# EAGLE design i2cdriver (EAGLE 6.4)
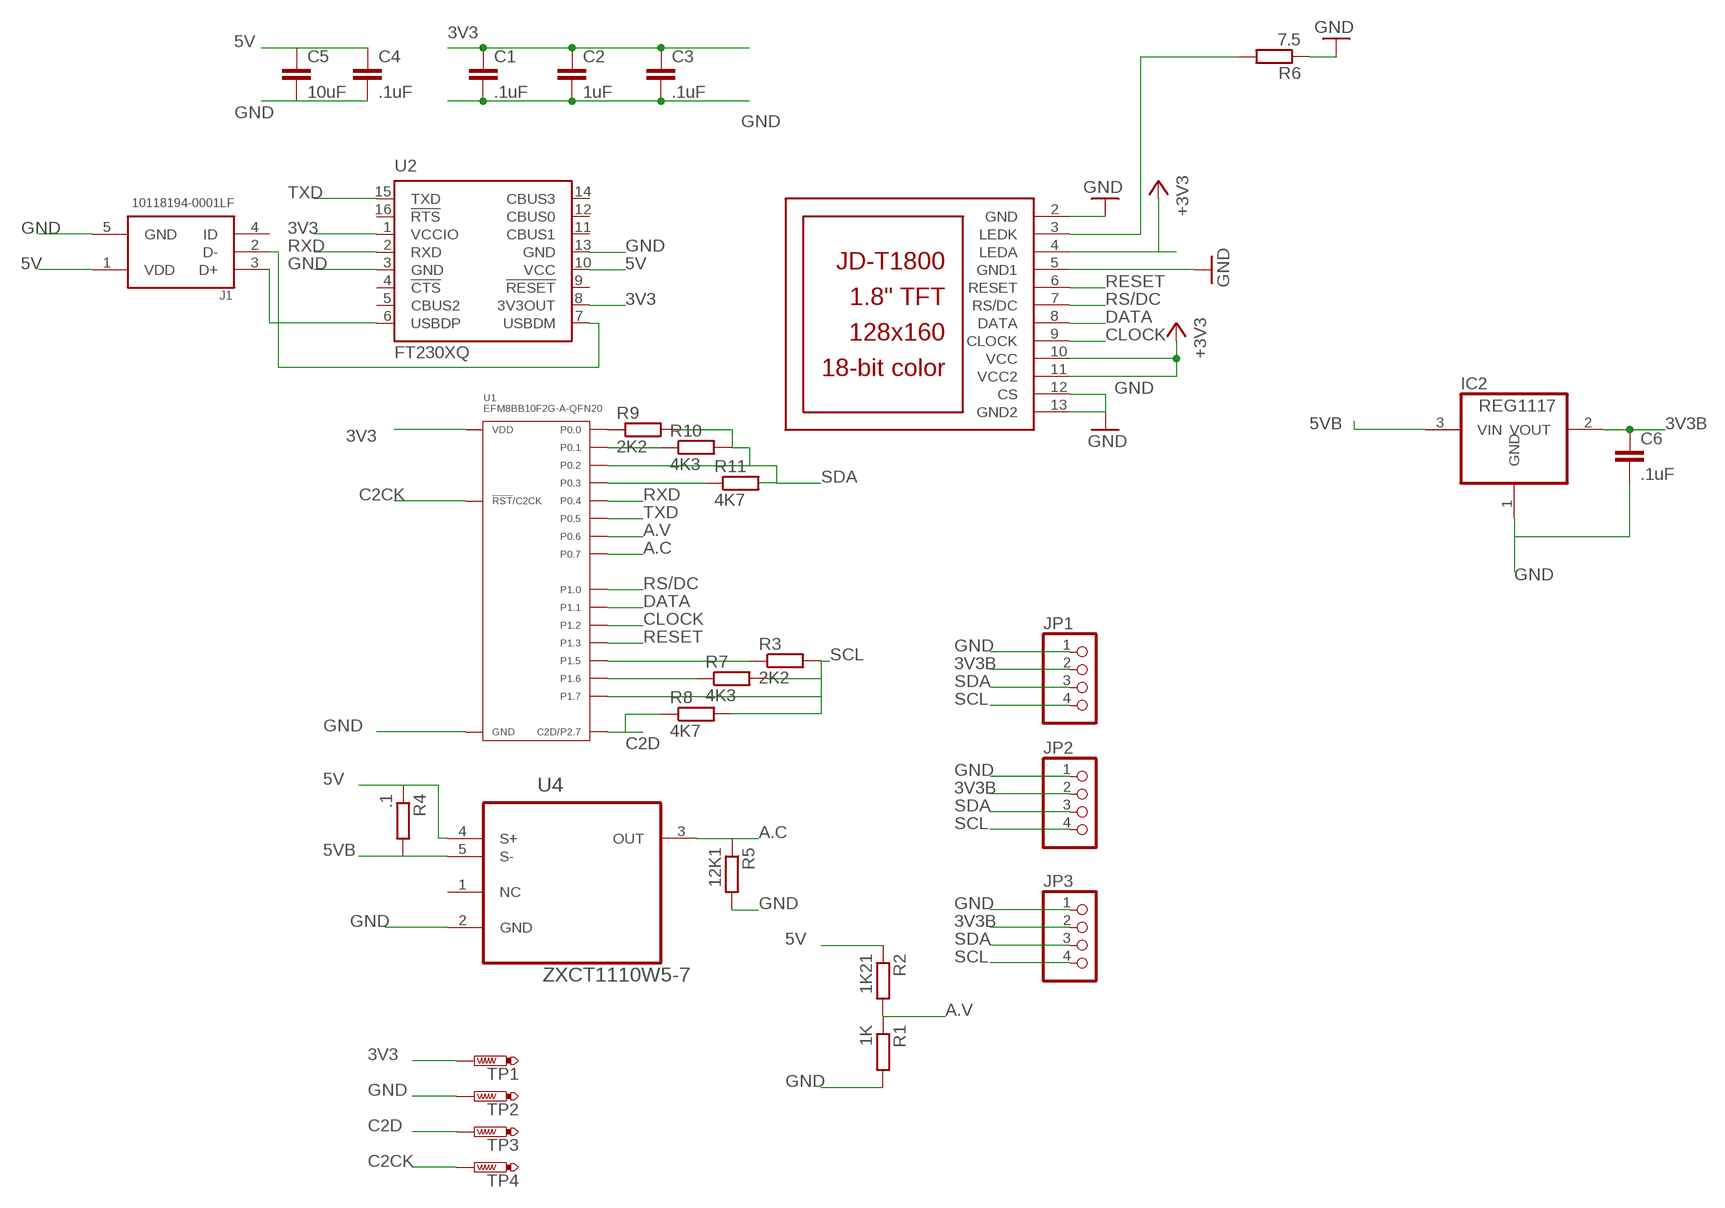
[diagram p0: schematic, sheet 1]

## Parts
C1  .1uF  C-EUC0402K  [C0402K]
C2  1uF  C-EUC0402K  [C0402K]
C3  .1uF  C-EUC0402K  [C0402K]
C4  .1uF  C-EUC0402K  [C0402K]
C5  10uF  C-EUC0402K  [C0402K]
C6  .1uF  C-EUC0402K  [C0402K]
IC2  REG1117  [SOT223]
J1  10118194-0001LF  [FRAMATOME_10118194-0001LF]
JP1  PINHD-1X4/90  [1X04/90]
JP2  PINHD-1X4/90  [1X04/90]
JP3  PINHD-1X4/90  [1X04/90]
R1  1K  R-EU_R0402  [R0402]
R2  1K21  R-EU_R0402  [R0402]
R3  2K2  R-EU_R0402  [R0402]
R4  .1  R-EU_R0805  [R0805]
R5  12K1  R-EU_R0402  [R0402]
R6  7.5  R-EU_R0402  [R0402]
R7  4K3  R-EU_R0402  [R0402]
R8  4K7  R-EU_R0402  [R0402]
R9  2K2  R-EU_R0402  [R0402]
R10  4K3  R-EU_R0402  [R0402]
R11  4K7  R-EU_R0402  [R0402]
TP1  PTR1B1,27  [B1,27]
TP2  PTR1B1,27  [B1,27]
TP3  PTR1B1,27  [B1,27]
TP4  PTR1B1,27  [B1,27]
U1  EFM8BB10F2G-A-QFN20  EFM8BB10F(2/4/8)G-A-QFN20  [EFM8BB10F(2/4/8)G-A-QFN20]
U2  FT230XQ  [QFN16]
U4  ZXCT1110W5-7  [SOT95P280X130-5N]
U$1  JD-T1800  [JD-T1800]

## Nets
3V3: C1.1 C2.1 C3.1 TP1.TP U1.P$4(VDD) U2.1(VCCIO) U2.8(3V3OUT) U$1.4(LEDA) U$1.10(VCC) U$1.11(VCC2) ; supply symbol labelled +3V3
3V3B: C6.1 IC2.2(VOUT) JP1.2 JP2.2 JP3.2
5V: C4.1 C5.1 J1.1(VDD) R2.1 R4.1 U2.10(VCC) U4.4(S+)
5VB: IC2.3(VIN) R4.2 U4.5(S-)
A.C: R5.1 U1.P$15(P0.7) U4.3(OUT)
A.V: R1.1 R2.2 U1.P$16(P0.6)
C2CK: TP4.TP U1.P$5(!RST!/C2CK)
C2D: R8.1 TP3.TP U1.P$6(C2D/P2.7)
C2D1: R11.1 U1.P$19(P0.3)
CLOCK: U1.P$11(P1.2) U$1.9(CLOCK)
DATA: U1.P$13(P1.1) U$1.8(DATA)
GND: C1.2 C2.2 C3.2 C4.2 C5.2 C6.2 IC2.1(GND) J1.5(GND) JP1.1 JP2.1 JP3.1 R1.2 R5.2 R6.1 TP2.TP U1.P$3(GND) U1.P$12(GND) U1.PAD(GND) U2.3(GND) U2.13(GND) U4.2(GND) U$1.2(GND) U$1.5(GND1) U$1.12(CS) U$1.13(GND2)
N$1: R10.1 U1.P$1(P0.1)
N$2: R7.1 U1.P$7(P1.6)
N$3: R3.1 U1.P$8(P1.5)
N$4: R6.2 U$1.3(LEDK)
N$5: R9.1 U1.P$2(P0.0)
N$19: J1.3(D+) U2.6(USBDP)
N$20: J1.2(D-) U2.7(USBDM)
RESET: U1.P$10(P1.3) U$1.6(RESET)
RS/DC: U1.P$14(P1.0) U$1.7(RS/DC)
RXD: U1.P$18(P0.4) U2.2(RXD)
SCL: JP1.4 JP2.4 JP3.4 R3.2 R7.2 R8.2 U1.P$9(P1.7)
SDA: JP1.3 JP2.3 JP3.3 R9.2 R10.2 R11.2 U1.P$20(P0.2)
TXD: U1.P$17(P0.5) U2.15(TXD)
Unconnected: J1.4(ID) U2.4(!CTS) U2.5(CBUS2) U2.9(!RESET) U2.11(CBUS1) U2.12(CBUS0) U2.14(CBUS3) U2.16(!RTS) U4.1(NC)

## Library data of the parts
C1-C6 = resistor:C-EU: CAPACITOR, European symbol
IC2 = burr-brown:REG1117: 800mA and 1A Low Dropout (LDO) Positive Regulator 1.8V, 2.5V, 2.85V, 3.3V, 5V, and Adj; MPN: REG1117; OC_FARNELL: 1097566; OC_NEWARK: 14P6981
J1 = 10118194-0001LF:10118194-0001LF: Conn Micro USB Type B RCP 5 POS 0.65mm Solder RA SMD 5 Terminal 1 Port T/R; AVAILABILITY: Good; DESCRIPTION: Conn Micro USB Type B RCP 5 POS 0.65mm Solder RA SMD 5 Terminal 1 Port T/R; MF: Amphenol; MP: 10118194-0001LF; PACKAGE: None; PRICE: 0.24 USD
JP1-JP3 = pinhead:PINHD-1X4: PIN HEADER
R1-R3 R5 R7-R11 = resistor:R-EU_: RESISTOR, European symbol
R4 R6 = rcl:R-EU_: RESISTOR, European symbol
TP1-TP4 = testpad:PTR1: TEST PIN
U1 = MF_IC_Digital:EFM8BB10F(2/4/8)G-A-QFN20: Manufacturer Part #: EFM8BB10F(2/4/8)G-A-QFN20 Manufacturer: Silicon Labs Description: Busy Bee 8-bit Microcontrollers - MCU (2/4/8)kB / (256/512)B RAM 12b ADC; HOUSEPART: NO; MPN: EFM8BB10F2G-A-QFN20; POPULATE: 1; URL: http://www.silabs.com/products/mcu/8-bit/efm8-busy-bee/Pages/efm8-busy-bee.aspx
U2 = ftdichip:FT230X: USB to BASIC UART IC Auto generated by make-symbol-device-package-bsdl.ulp Rev. 43 Source: Data sheet <http://www.ftdichip.com/Support/Documents/DataSheets/ICs/DS_FT230X.pdf>
U4 = ZXCT1110W5-7:ZXCT1110W5-7: LOW POWER HIGH-SIDE CURRENT MONITORS; AVAILABILITY: Good; DESCRIPTION: Battery Management IC Automotive 5-Pin SOT-25 T/R; MF: Diodes Inc.; MP: ZXCT1110W5-7; PACKAGE: SOT-753 Diodes Inc.; PRICE: 0.57 USD
U$1 = adafruit:JD-T1800

## Net classes
1 power: width 0.406 mm

## Board
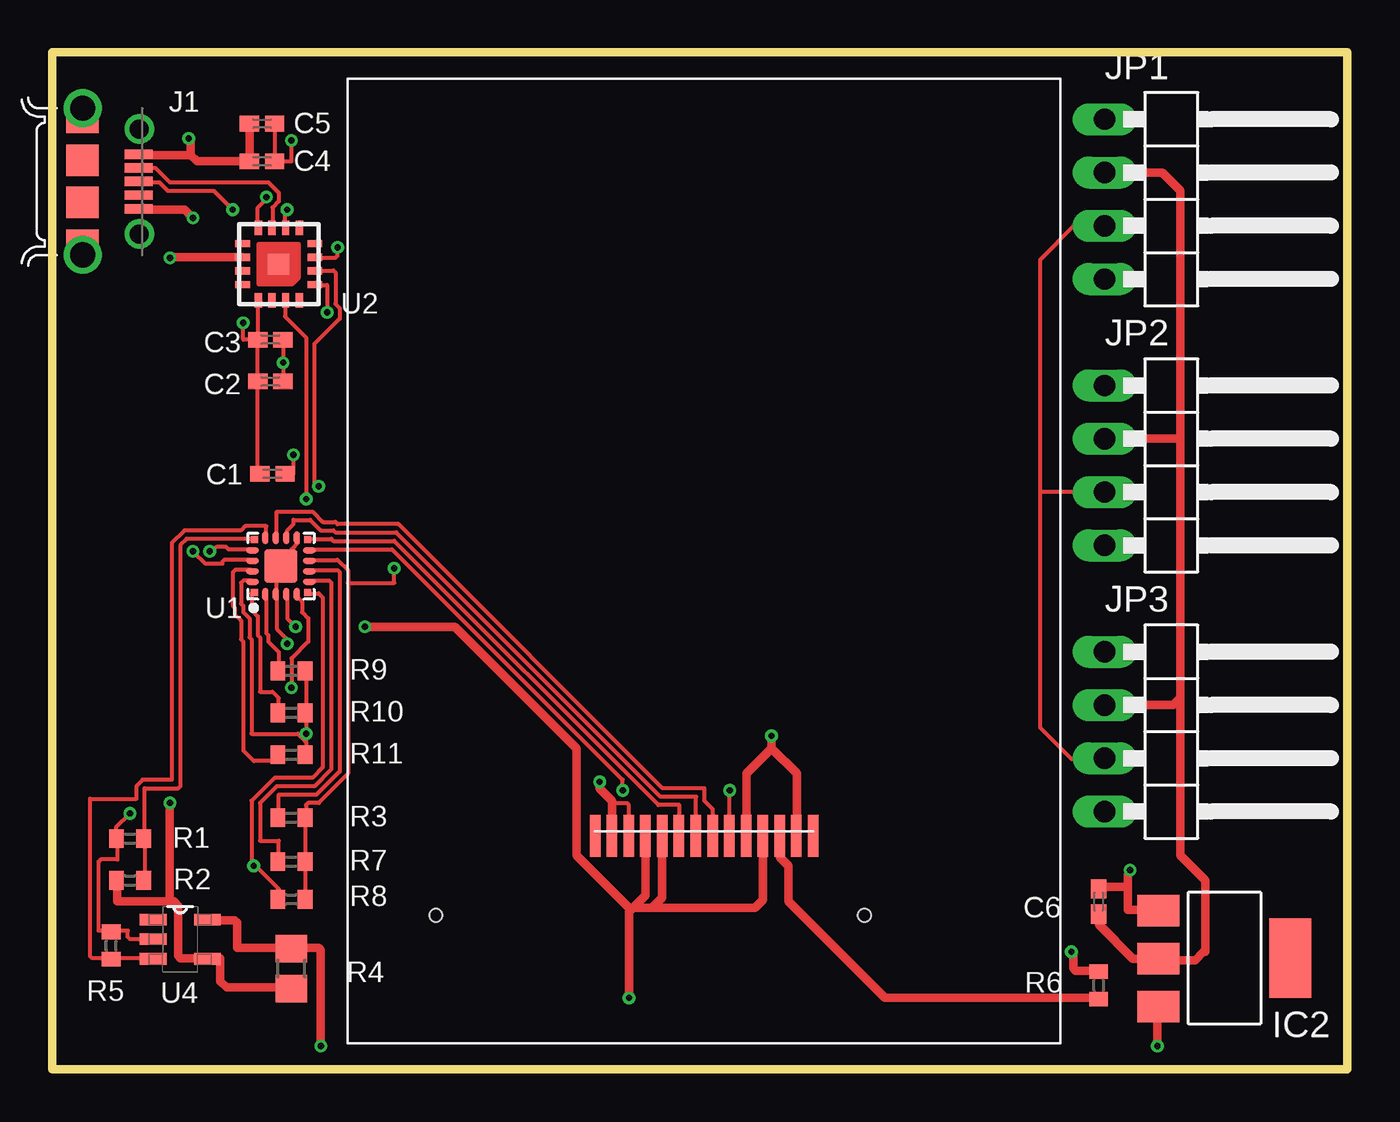
[diagram p1: board, top side]
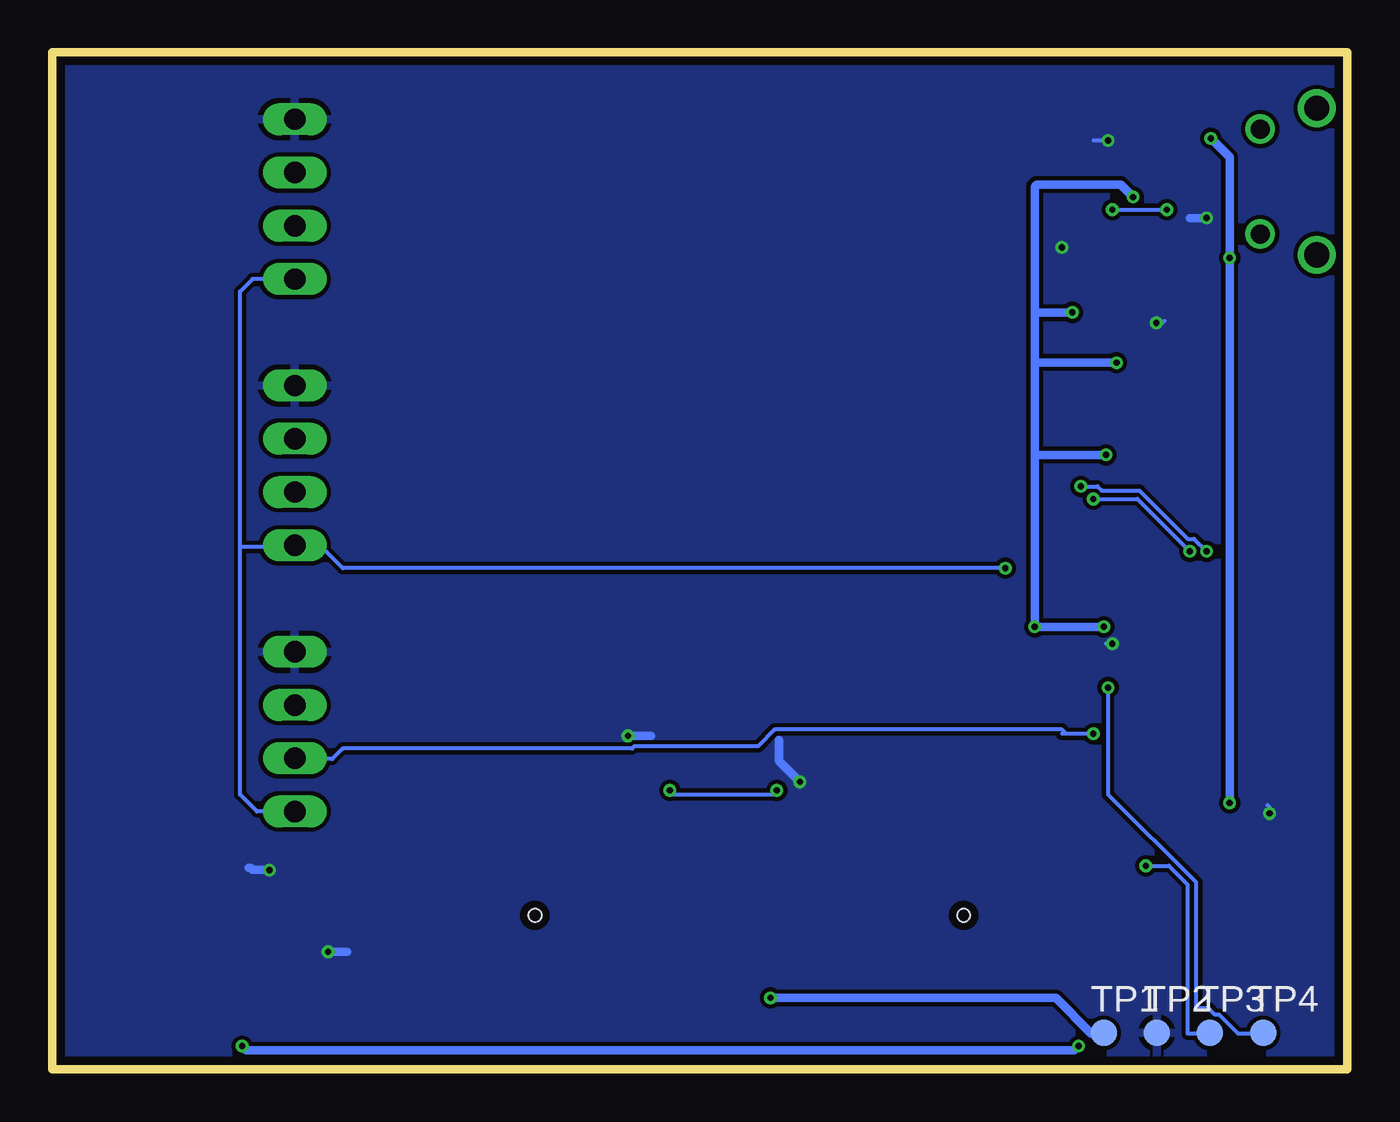
[diagram p2: board, bottom side, seen from below]

Size 61.75 x 48.5 mm. Coordinates in mm from the lower left corner, seen from the top.
Outline: 0,0 61.75,0 61.75,48.5 0,48.5 0,0
Copper layers (1*16): Top 0.035mm / dielectric 1.5mm / Bottom 0.035mm
Design rules "NOA Eagle Rule 2016-06-12": minimum track width 6mil, minimum drill 0.3mm, track to track 6mil, track to pad 6mil, pad to pad 6mil, via to via 6mil, smd to smd 0mil, copper to edge 0.4mm, drill to drill 10mil, minimum pad ring 10mil, minimum via ring 6mil, stop-mask expansion 2mil, vias tented up to drill 25mil, thermal gap 10mil

### Footprints (pad centres in the part's own frame; a part is rotated, then mirrored left to right if it is on the bottom)
C0402K = smd 0.925 x 0.74: 1 -0.6,0; 2 0.6,0
SOT223 = smd 1.499 x 2.007: 1 -2.261,-3.15; 2 0.025,-3.15; 3 2.311,-3.15 | smd 3.81 x 2.007: 4 0,3.15
FRAMATOME_10118194-0001LF = smd 0.45 x 1.35: 1 -1.3,2.675; 2 -0.65,2.675; 3 0,2.675; 4 0.65,2.675; 5 1.3,2.675 | drill 0.9: P$6 -2.5,2.7; P$7 2.5,2.7 | drill 1.2: P$8 -3.5,0; P$9 3.5,0 | smd 1.5 x 1.55: P$10 -1,0; P$11 1,0; P$12 -3.05,0; P$13 3.05,0
1X04/90 = drill 1.016 long: 1 -3.81,-3.81; 2 -1.27,-3.81; 3 1.27,-3.81; 4 3.81,-3.81
R0402 = smd 0.7 x 0.9: 1 -0.65,0; 2 0.65,0
R0805 = smd 1.3 x 1.5: 1 -0.95,0; 2 0.95,0
B1,27 = smd 1.27 x 1.27: TP 0,0
EFM8BB10F(2/4/8)G-A-QFN20 = smd 0.34 x 0.34: P$1 -1.265,1.265; P$6 -1.265,-1.265; P$11 1.265,-1.265; P$16 1.265,1.265 | smd 0.61 x 0.28: P$2 -1.355,0.75; P$3 -1.355,0.25; P$4 -1.355,-0.25; P$5 -1.355,-0.75; P$12 1.355,-0.75; P$13 1.355,-0.25; P$14 1.355,0.25; P$15 1.355,0.75 | smd 0.28 x 0.61: P$7 -0.75,-1.355; P$8 -0.25,-1.355; P$9 0.25,-1.355; P$10 0.75,-1.355; P$17 0.75,1.355; P$18 0.25,1.355; P$19 -0.25,1.355; P$20 -0.75,1.355 | smd 1.6 x 1.6: PAD 0,0
QFN16 = smd 0.7 x 0.35: 1 -1.725,0.975; 2 -1.725,0.325; 3 -1.725,-0.325; 4 -1.725,-0.975; 9 1.725,-0.975; 10 1.725,-0.325; 11 1.725,0.325; 12 1.725,0.975 | smd 0.35 x 0.7: 5 -0.975,-1.725; 6 -0.325,-1.725; 7 0.325,-1.725; 8 0.975,-1.725; 13 0.975,1.725; 14 0.325,1.725; 15 -0.325,1.725; 16 -0.975,1.725 | smd 1 x 1: TAB 0,0
SOT95P280X130-5N = smd 1.27 x 0.559: 1 -1.295,0.94; 2 -1.295,0; 3 -1.295,-0.94; 4 1.295,-0.94; 5 1.295,0.94
JD-T1800 = smd 0.5 x 2: 1 5.2,-13.1; 2 4.4,-13.1; 3 3.6,-13.1; 4 2.8,-13.1; 5 2,-13.1; 6 1.2,-13.1; 7 0.4,-13.1; 8 -0.4,-13.1; 9 -1.2,-13.1; 10 -2,-13.1; 11 -2.8,-13.1; 12 -3.6,-13.1; 13 -4.4,-13.1; 14 -5.2,-13.1 | hole 0.6: -12.8,-16.9; 7.65,-16.9

### Placement (x,y rotation side)
C1  10.5,28.4 180 top
C2  10.4,32.8 180 top
C3  10.4,34.8 180 top
C4  10,43.3 0 top
C5  10,45.1 0 top
C6  49.9,8 90 top
IC2  55.9,5.3 270 top
J1  1.44,42.34 270 top
JP1  54,41.5 270 top
JP2  54,28.8 270 top
JP3  54,16.1 270 top
R1  3.7,11 180 top
R2  3.7,9 0 top
R3  11.4,12 0 top
R4  11.4,4.8 90 top
R5  2.8,5.9 90 top
R6  49.9,4 270 top
R7  11.4,9.9 0 top
R8  11.4,8.1 0 top
R9  11.4,19 0 top
R10  11.4,17 0 top
R11  11.4,15 0 top
TP1  11.61,1.73 0 bottom
TP2  9.08,1.73 0 bottom
TP3  6.54,1.73 0 bottom
TP4  4.01,1.73 0 bottom
U1  10.9,24 90 top
U2  10.8,38.4 180 top
U4  6.1,6.2 0 top
U$1  31.08,24.24 0 top

### Tracks (layer width: path | path; a pad name or v marks a point on that pad's centre or on a via)
3V3  (via drill 0.3)
  Top 0.2: 28.3,11.1 U$1.11 | 11.2,22.6 U1.P$4 11.2,22.5 11.2,21.5 v11.6,21.1 | 12.6,37.4 U2.1 12.7,37.4 13.1,37.4 v13.1,36.1 13.1,36 | C3.1 v11,33.7 C2.1 | v11.5,29.3 11.5,28.4 C1.1 | U2.8 9.8,40.2 9.8,41.1 10.2,41.5 v10.2,41.6
  Top 0.4: 27.7,7.7 28.3,8.3 28.3,11 U$1.11 | U$1.10 29.08,8.18 28.6,7.7 | U$1.4 33.88,8.08 33.5,7.7 28.6,7.7 | 28.6,7.7 27.7,7.7 | v14.9,21.1 19.2,21.1 25,15.3 25,10.2 27.6,7.6 | 27.6,7.6 27.7,7.7 | v27.5,3.4 27.5,7.5 27.6,7.6
  Bottom 0.4: 11.7,1.7 TP1.TP 11.9,1.7 12.2,1.7 13.9,3.4 v27.5,3.4 | v11.6,21.1 v14.9,21.1 14.9,29.3 | 14.9,29.3 14.9,33.7 | 14.9,33.7 14.9,36.1 | 14.9,36.1 14.9,42.1 14.8,42.2 10.8,42.2 v10.2,41.6 | v11,33.7 14.9,33.7 | v11.5,29.3 14.9,29.3 | 14.9,36.1 v13.1,36.1
3V3B
  Top 0.4: JP1.2 52.93,42.77 53.8,41.9 53.8,30 | 53.8,30 53.8,17.7 | 53.8,17.7 53.8,10.2 55,9 55,5.6 54.9,5.6 54.5,5.2 52.82,5.2 IC2.2 51.52,5.28 49.9,6.9 C6.1 | JP2.2 53.73,30.07 53.8,30 | JP3.2 53.47,17.37 53.8,17.7
5V  (via drill 0.3)
  Top 0.2: 7.4,5.3 U4.4
  Top 0.4: R4.1 11.4,3.9 8.3,3.9 8,4.2 8,5.3 7.5,5.3 U4.4 7.2,5.3 6.1,5.3 6,5.4 6,7.8 5.8,8 5.6,8 | 5.6,8 3.1,8 3.1,9 R2.1 | 6.6,43.6 4.2,43.6 J1.1 | 6.6,43.6 6.9,43.3 C4.1 C5.1 | 5.6,8 v5.6,12.7 | 6.6,43.6 6.6,44.3 v6.5,44.4 | U2.10 5.63,38.72 v5.6,38.7
  Bottom 0.4: v5.6,12.7 v5.6,38.7 5.6,43.5 v6.5,44.4
5VB  (via drill 0.3)
  Top 0.4: U4.5 7.4,7.1 8.7,7.1 8.8,7 8.8,5.8 11.4,5.8 R4.2 11.5,5.8 12.7,5.8 12.8,5.7 v12.8,1.1 | v52.7,1.1 52.7,2.9 IC2.3
  Bottom 0.4: v12.8,1.1 13,0.9 52.5,0.9 v52.7,1.1
A.C
  Top 0.2: U1.P$15 10.2,25.4 10.2,25.9 9.2,25.9 9,25.7 6.3,25.7 5.7,25.1 5.7,13.8 4.3,13.8 4,13.5 4,12.9 1.8,12.9 1.8,5.4 1.9,5.3 2.8,5.3 | 2.8,5.3 4.8,5.3 U4.3 | 2.8,5.3 R5.1
A.V
  Top 0.2: U1.P$16 9.6,25.3 6.4,25.3 6.1,25 6.1,13.5 6,13.4 4.4,13.4 4.4,11 | 4.4,11 4.4,9 R2.2 | 4.4,11 R1.1
C2CK  (via drill 0.3)
  Top 0.2: v11.4,18.2 11.4,19.6 12.2,20.4 12.2,21.5 11.9,21.8 11.9,22.3 11.7,22.5 U1.P$5 11.7,22.6
  Bottom 0.2: v11.4,18.2 11.4,13.1 7.2,8.9 7.2,2.9 6.6,2.9 6.3,2.6 6.1,2.6 5.2,1.7 4.1,1.7 TP4.TP
C2D  (via drill 0.3)
  Top 0.2: U1.P$6 12.2,22.7 12.7,22.7 12.9,22.5 12.9,14.4 12.4,13.9 10.6,13.9 9.5,12.8 9.5,9.9 9.65,9.75 | 9.65,9.75 10.8,8.6 10.8,8.1 R8.1 | v9.6,9.7 9.65,9.75
  Bottom 0.2: TP3.TP 6.6,1.7 7.6,1.7 7.6,8.8 8.5,9.7 v9.6,9.7
C2D1
  Top 0.2: U1.P$19 9.5,23.8 8.7,23.8 8.6,23.7 8.6,22.1 8.7,22 8.7,21.7 9,21.4 9,20.5 9.1,20.4 9.1,15.2 9.6,14.7 10.8,14.7 10.8,15 R11.1
CLOCK
  Top 0.2: U1.P$11 12.2,25.3 13.3,25.3 13.4,25.2 16.3,25.2 28.9,12.6 29.9,12.6 29.9,11.2 U$1.9
DATA
  Top 0.2: U1.P$13 11.2,25.4 11.2,25.7 11.5,26 11.5,26.2 12.3,26.2 12.8,25.7 13.4,25.7 13.5,25.6 16.4,25.6 29,13 30.7,13 30.7,11.2 U$1.8
GND  (via drill 0.3)
  Top 0.2: 2.8,6.6 3.6,6.6 3.6,6.3 3.7,6.2 U4.2 | v3.7,12.2 3.05,11.55 R1.2 3.1,11 3.1,10 2.3,10 2.2,9.9 2.2,6.6 2.8,6.6 | 2.8,6.6 R5.2 | v11.2,20.3 11.2,20.5 10.7,21 10.7,22.6 U1.P$3 10.7,22.7 10.7,24 U1.PAD 11.4,24 11.4,24.8 11.7,25.1 11.7,25.3 U1.P$12 | 9.8,32.7 9.8,28.4 C1.2 | 9.8,34.7 9.8,32.9 9.7,32.8 9.8,32.7 | 9.8,32.7 C2.2 | 9.7,34.8 9.8,34.9 9.8,36.6 | 9.8,34.7 9.7,34.8 | 9.8,36.6 U2.13 | 9.8,34.7 C3.2 9.7,34.8 | U2.3 12.6,38.7 13.5,38.7 13.6,38.8 v13.6,39.2 | C5.2 C4.2 11.4,43.3 v11.4,44.3 | 9.9,36.6 9.8,36.6 | v9.1,35.6 9.1,34.8 9.7,34.8 | U$1.12 27.5,11.2 27.5,12.6 27.4,12.7 26.7,12.7
  Top 0.4: U$1.13 26.7,11.15 26.7,12.7 26.7,12.8 26.1,13.4 v26.1,13.7 | U$1.5 33.1,11.15 33.1,14.1 34.3,15.3 | U$1.2 35.5,11.15 35.5,14.1 34.3,15.3 | 34.3,15.3 v34.3,15.9 | v6.7,40.6 6.3,41 4.2,41 J1.5 | C6.2 49.9,8.7 51.3,8.7 | IC2.1 52.7,7.6 51.3,7.6 51.3,8.7 | 51.3,8.7 51.3,9.3 51.4,9.4 v51.4,9.5 | R6.1 49.9,4.7 48.8,4.7 48.7,4.8 48.7,5.5 v48.6,5.6
  Bottom 0.2: v3.7,12.2 3.7,12.5 3.8,12.6 | v11.2,20.3 11.5,20.3 | v13.6,39.2 13.8,39.2 | v11.4,44.3 12.1,44.3 | v9.1,35.6 8.8,35.6 8.7,35.7
  Bottom 0.4: v26.1,13.7 27.1,14.7 27.1,15.7 | v34.3,15.9 33.2,15.9 | v6.7,40.6 7.5,40.6 | v51.4,9.5 52.2,9.5 52.3,9.6 52.4,9.6 | v48.6,5.6 47.7,5.6
  pour Bottom (isolate 0.305): 0.1,0 61.7,0 0,-0.1
  pour Bottom (isolate 0.2): 0,0 61.8,0 61.8,48.5 0,48.5
N$1
  Top 0.2: R10.1 10.8,17 10.8,17.7 10.5,18 9.9,18 9.9,20.6 9.8,20.7 9.8,21.6 9.5,21.9 9.5,22.7 9.6,22.8 U1.P$1
N$2
  Top 0.2: U1.P$7 12.3,23.3 13.2,23.3 13.3,23.2 13.3,14.3 12.5,13.5 10.7,13.5 9.9,12.7 9.9,10.9 10.8,10.9 10.8,9.9 R7.1
N$3
  Top 0.2: U1.P$8 12.3,23.8 13.6,23.8 13.7,23.7 13.7,14.2 12.6,13.1 10.8,13.1 10.8,12 R3.1
N$4
  Top 0.2: 34.7,11.2 U$1.3
  Top 0.4: U$1.3 34.7,11.1 34.7,10.1 35.1,9.7 35.1,8 39.7,3.4 49.9,3.4 R6.2
N$5
  Top 0.2: U1.P$2 10.2,22.6 10.2,20.8 10.3,20.7 10.3,20.4 10.8,19.9 10.8,19 R9.1
N$19  (via drill 0.3)
  Top 0.2: v11.2,41 11.1,41 11.1,40.2 U2.6 | v8.6,41 7.7,41.9 5.5,41.9 5.1,42.3 4.2,42.3 J1.3
  Bottom 0.2: v11.2,41 v8.6,41
N$20
  Top 0.2: U2.7 10.5,40.2 10.5,41.1 10.8,41.4 10.8,41.8 10.3,42.3 5.6,42.3 4.9,43 4.2,43 J1.2
RESET  (via drill 0.3)
  Top 0.2: U1.P$10 12.3,24.8 16.2,24.8 27.2,13.8 v27.2,13.3 | v32.3,13.3 32.3,11.2 U$1.6
  Bottom 0.2: v27.2,13.3 27.4,13.1 32.1,13.1 v32.3,13.3
RS/DC
  Top 0.2: U1.P$14 10.7,25.4 10.7,26.6 12.4,26.6 12.9,26.1 13.5,26.1 13.6,26 16.5,26 29.1,13.4 31.1,13.4 31.1,12.8 31.5,12.4 31.5,11.2 U$1.7
RXD  (via drill 0.3)
  Top 0.2: U1.P$18 9.5,24.3 8.2,24.3 8.1,24.2 8.1,24.1 7.3,24.1 v6.7,24.7 | 12.6,38.1 U2.2 12.7,38.1 13.4,38.1 13.5,38 13.5,36.5 13.7,36.3 13.7,35.8 12.5,34.6 12.5,28 v12.7,27.8
  Bottom 0.2: v6.7,24.7 7.3,25.3 7.6,25.3 9.9,27.6 11.7,27.6 11.9,27.8 v12.7,27.8
SCL  (via drill 0.3)
  Top 0.2: R8.2 R7.2 R3.2 12.1,12 12.1,12.6 12.2,12.7 12.7,12.7 14.1,14.1 14.1,23.2 | 14.1,23.2 14.1,23.8 13.6,24.3 12.3,24.3 U1.P$9 | 14.1,23.2 16.3,23.2 v16.3,23.9
  Bottom 0.2: 48.9,24.9 49,25 50.1,25 JP2.4 | v16.3,23.9 47.9,23.9 48.9,24.9 | JP3.4 51.99,12.29 52.8,13.1 52.8,24.9 | 52.8,24.9 52.8,37.1 52.21,37.69 JP1.4 | 48.9,24.9 52.8,24.9
SDA  (via drill 0.3)
  Top 0.2: 12.05,15.65 11.7,16 9.5,16 9.5,20.5 9.4,20.6 9.4,21.5 9.1,21.8 9.1,22.1 9,22.2 9,23.2 9.1,23.3 9.5,23.3 U1.P$20 | 12.05,15.65 12.1,15.6 12.1,15 R11.2 | 12.1,17 12.1,19 R9.2 | 12.1,17 v12.1,16 12.1,15.7 12.05,15.65 | 12.1,17 R10.2 | JP1.3 48.73,40.23 47.1,38.6 47.1,27.5 | 47.1,27.5 47.1,16.3 48.6,14.8 50.16,14.8 JP3.3 | JP2.3 47.13,27.53 47.1,27.5
  Bottom 0.2: v12.1,16 13.4,16 | 13.4,16 13.6,16 | 13.4,16 13.6,16.2 27.3,16.2 28.1,15.4 34,15.4 34.1,15.3 47.9,15.3 48.4,14.8 50.1,14.8 JP3.3
TXD  (via drill 0.3)
  Top 0.2: U1.P$17 9.5,24.8 8.4,24.8 8.3,24.9 7.8,24.9 7.5,24.6 v7.5,24.7 | v12.1,27.2 12.1,34.9 11.1,35.9 11.1,36.6 U2.15
  Bottom 0.2: v7.5,24.7 10,27.2 v12.1,27.2